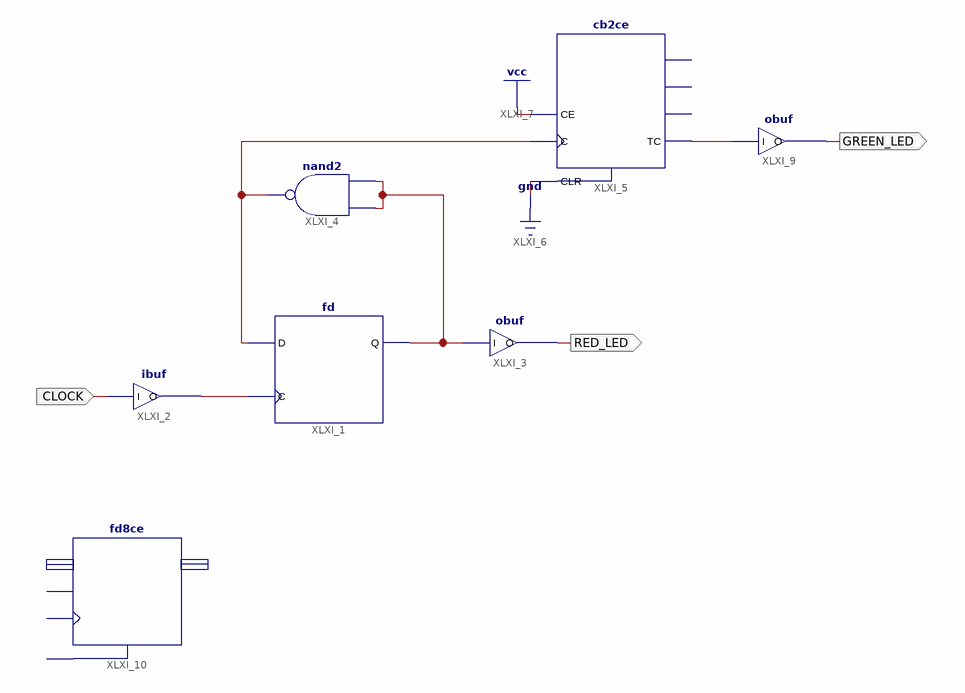
[diagram p0: schematic sheet 1]
// Xilinx ISE schematic blink.sch (xc9500xl) as structural Verilog: 7 symbols, 3 ports
module blink (
  input  CLOCK,
  output RED_LED,
  output GREEN_LED
);

  wire XLXN_2, XLXN_3, XLXN_7, XLXN_12;

  fd XLXI_1 (.C(XLXN_2), .D(XLXN_7), .Q(XLXN_3));
  ibuf #(.LOC("p5")) XLXI_2 (.I(CLOCK), .O(XLXN_2));
  obuf #(.LOC("p2")) XLXI_3 (.I(XLXN_3), .O(RED_LED));
  nand XLXI_4 (XLXN_7, XLXN_3, XLXN_3);
  cb2ce XLXI_5 (.C(XLXN_7), .CE(1'b1), .CLR(1'b0), .TC(XLXN_12));  // open: CEO, Q0, Q1
  obuf #(.LOC("p1")) XLXI_9 (.I(XLXN_12), .O(GREEN_LED));
  fd8ce XLXI_10 ();  // open: C, CE, CLR, D, Q
endmodule
